# EAGLE design 808-Diginoise (EAGLE 7.1.0)
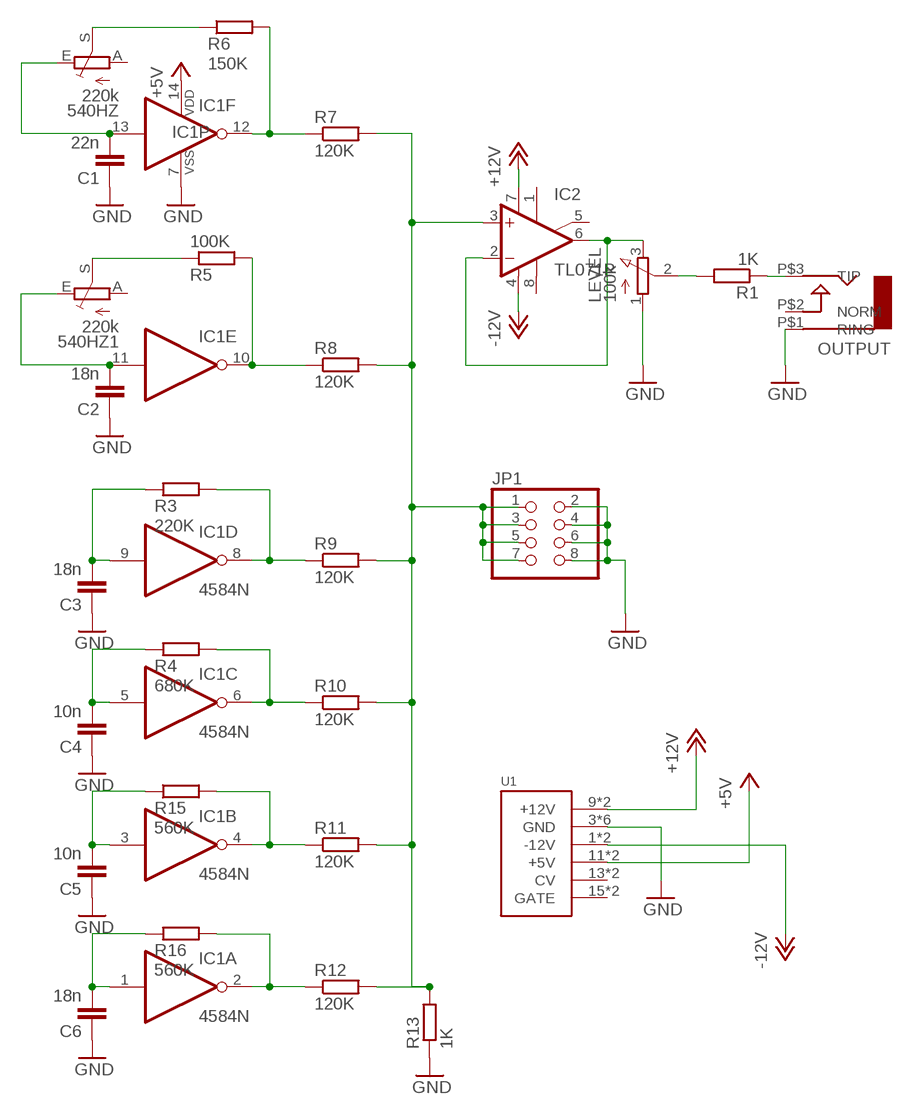
[diagram p0: schematic, sheet 1]

## Parts
540HZ  220k  TRIM_EU-B64Y  [B64Y]
540HZ1  220k  TRIM_EU-B64Y  [B64Y]
C1  22n  C-EU4MM_PITCH  [C035-030X60]
C2  18n  C-EU4MM_PITCH  [C035-030X60]
C3  18n  C-EU4MM_PITCH  [C035-030X60]
C4  10n  C-EU4MM_PITCH  [C035-030X60]
C5  10n  C-EU4MM_PITCH  [C035-030X60]
C6  18n  C-EU4MM_PITCH  [C035-030X60]
IC1  4584N  [DIL14]
IC2  TL071P  [DIL08]
JP1  PINHD-2X4  [2X04]
LEVEL  100k  3RP/1610N  [3RP/1610N]
OUTPUT  AUDIO-JACK  [ERTHENVAR-JACK-90DEG]
R1  1K  R-EU_0207/5V  [0207/5V]
R3  220K  R-EU_0207/5V  [0207/5V]
R4  680K  R-EU_0207/5V  [0207/5V]
R5  100K  R-EU_0207/5V  [0207/5V]
R6  150K  R-EU_0207/5V  [0207/5V]
R7  120K  R-EU_0207/5V  [0207/5V]
R8  120K  R-EU_0207/5V  [0207/5V]
R9  120K  R-EU_0207/5V  [0207/5V]
R10  120K  R-EU_0207/5V  [0207/5V]
R11  120K  R-EU_0207/5V  [0207/5V]
R12  120K  R-EU_0207/5V  [0207/5V]
R13  1K  R-EU_0207/5V  [0207/5V]
R15  560K  R-EU_0207/5V  [0207/5V]
R16  560K  R-EU_0207/5V  [0207/5V]
U1  POWER  [POWER_16]

## Nets
+5V: IC1.14(P:VDD) U1.11(+5V) U1.12(+5V)
+12V [Power]: IC2.7(V+) U1.9(+12V) U1.10(+12V)
-12V: IC2.4(V-) U1.1(-12V) U1.2(-12V)
GND [GND]: C1.P$1 C2.P$1 C3.P$1 C4.P$1 C5.P$1 C6.P$1 IC1.7(P:VSS) JP1.2 JP1.4 JP1.6 JP1.8 LEVEL.1(A) OUTPUT.P$1(RING) R13.1 U1.3(GND) U1.4(GND) U1.5(GND) U1.6(GND) U1.7(GND) U1.8(GND)
N$1: 540HZ1.E C2.P$2 IC1.11(E:I)
N$2: IC2.2(-IN) IC2.6(OUT) LEVEL.3(E)
N$3: 540HZ1.S R5.1
N$4: 540HZ.S R6.1
N$5: IC1.12(F:O) R6.2 R7.1
N$6: 540HZ.E C1.P$2 IC1.13(F:I)
N$7: LEVEL.2(S) R1.2
N$8: IC1.8(D:O) R3.2 R9.1
N$9: IC1.6(C:O) R4.2 R10.1
N$10: IC1.4(B:O) R11.1 R15.2
N$11: IC1.2(A:O) R12.1 R16.2
N$12: C3.P$2 IC1.9(D:I) R3.1
N$13: C6.P$2 IC1.1(A:I) R16.1
N$14: C5.P$2 IC1.3(B:I) R15.1
N$15: C4.P$2 IC1.5(C:I) R4.1
N$16: OUTPUT.P$3(TIP) R1.1
N$18: IC2.3(+IN) JP1.1 JP1.3 JP1.5 JP1.7 R7.2 R8.2 R9.2 R10.2 R11.2 R12.2 R13.2
TP7: IC1.10(E:O) R5.2 R8.1
Unconnected: 540HZ1.A 540HZ.A IC2.1(ON1) IC2.5(ON2) IC2.8(OPT) OUTPUT.P$2(NORM) U1.13(CV) U1.14(CV) U1.15(GATE) U1.16(GATE)

## Library data of the parts
540HZ 540HZ1 = bourns_ptd:TRIM_EU-: POTENTIOMETER
C1-C6 = TR808clone:C-EU: CAPACITOR, European symbol Pitch 3mm
IC1 = TR808clone:4584: Hex SCHMITT TRIGGER (74C14)
IC2 = linear:TL071: OP AMP
JP1 = adafruit:PINHD-2X4: PIN HEADER
LEVEL = pot:3RP/1610N: 16mm Potentiometer one level Source: http://www.alphapotentiometers.net/html/16mm_pot_2.html
OUTPUT = erthenvar:AUDIO-JACK: Switching Mono 3.5mm Audio Jack from Erthenvar.
R1 R3-R13 R15 R16 = TR808clone:R-EU_: RESISTOR, European symbol
U1 = eurorack:POWER

## Net classes
0 default: width 0.635 mm, drill 0.254 mm, clearance 0.254 mm
1 GND: width 1.016 mm, drill 1.016 mm, clearance 0.508 mm
2 Power: width 1.016 mm, drill 1.016 mm, clearance 0.508 mm

## Board
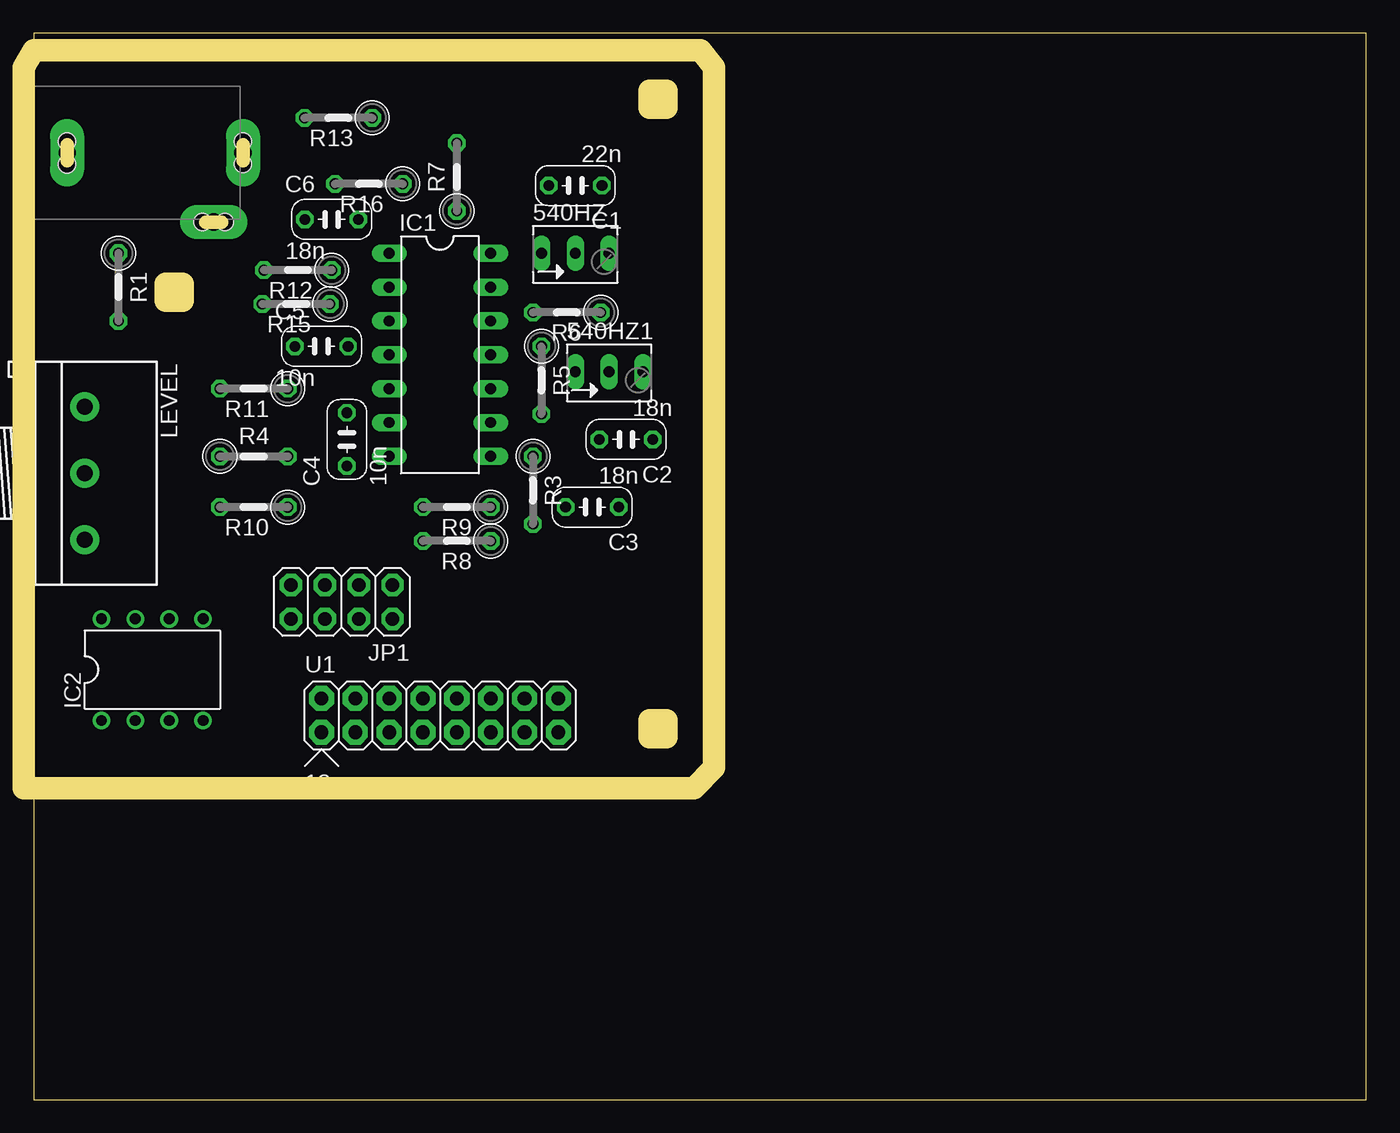
[diagram p1: board, top side]
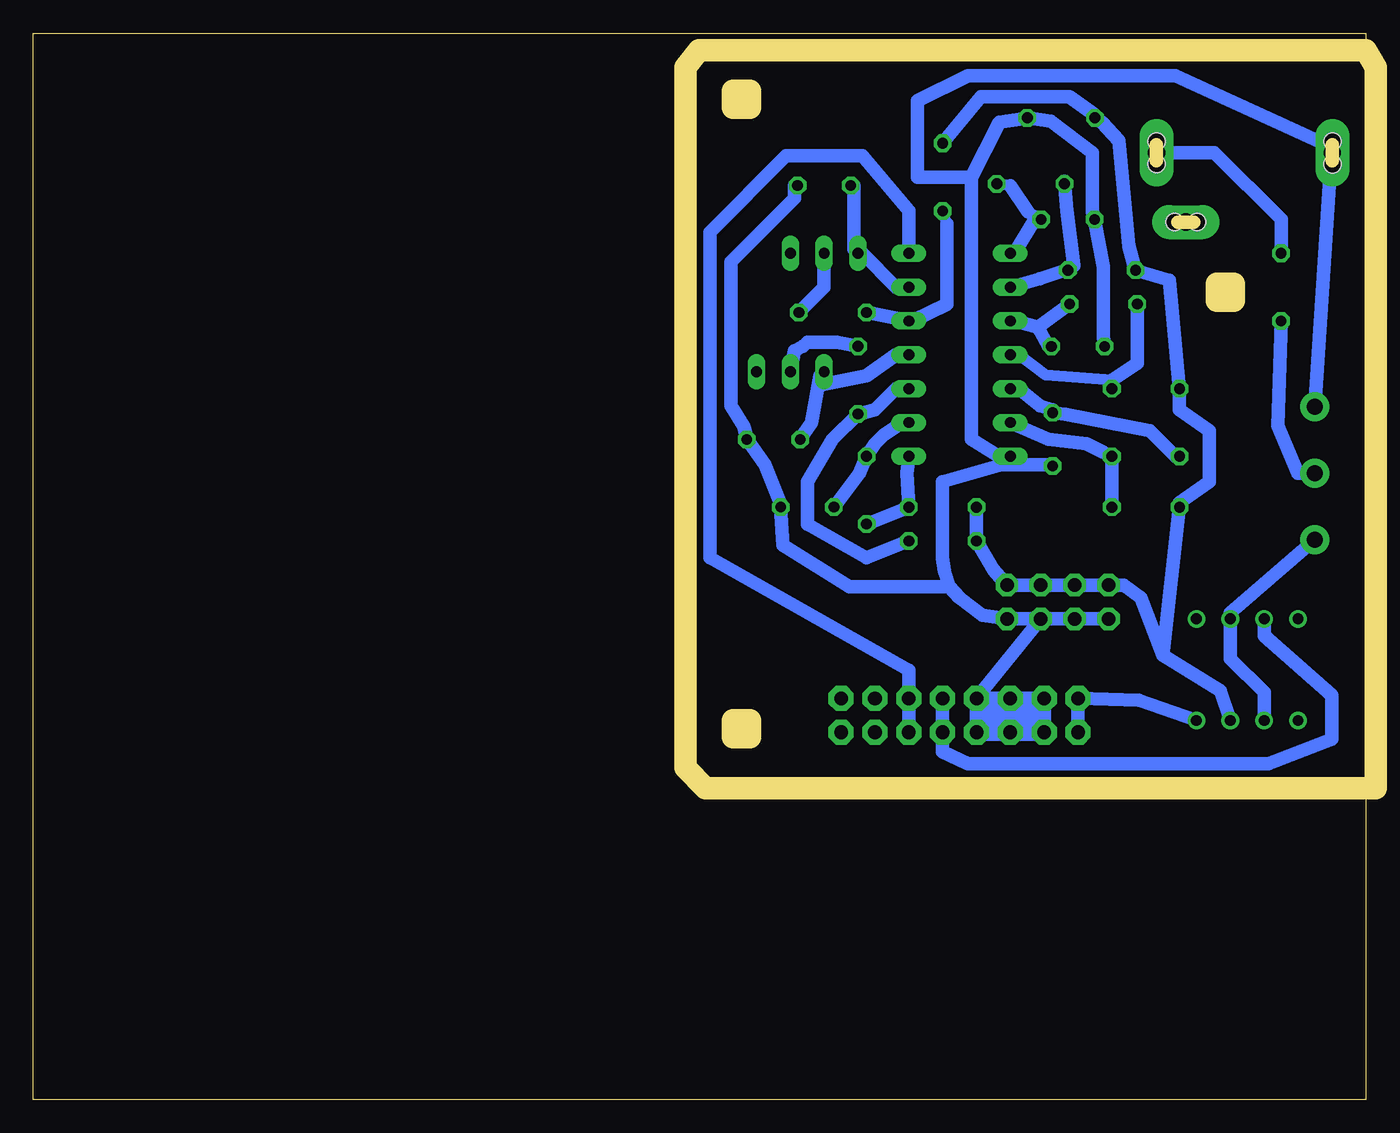
[diagram p2: board, bottom side, seen from below]

Size 100 x 80 mm. Coordinates in mm from the lower left corner, seen from the top.
Outline: 0,0 100,0 100,80 0,80 0,0
Copper layers (1*16): Top 0.035mm / dielectric 1.5mm / Bottom 0.035mm
Design rules "default *": minimum track width 32mil, minimum drill 31mil, track to track 18mil, track to pad 18mil, pad to pad 18mil, via to via 18mil, smd to smd 8mil, copper to edge 0mil, drill to drill 18mil, minimum pad ring 10mil, minimum via ring 8mil, stop-mask expansion 4mil, vias tented up to drill 0mil, thermal gap 10mil
Milling: 19 lines

### Footprints (pad centres in the part's own frame; a part is rotated, then mirrored left to right if it is on the bottom)
B64Y = drill 0.813 long: A 2.54,0; E -2.54,0; S 0,0
C035-030X60 = drill 0.8 octagon: P$1 -2,0; P$2 2,0
DIL14 = drill 0.813 long: 1 -7.62,-3.81; 2 -5.08,-3.81; 3 -2.54,-3.81; 4 0,-3.81; 5 2.54,-3.81; 6 5.08,-3.81; 7 7.62,-3.81; 8 7.62,3.81; 9 5.08,3.81; 10 2.54,3.81; 11 0,3.81; 12 -2.54,3.81; 13 -5.08,3.81; 14 -7.62,3.81
DIL08 = drill 0.813 pad 1.27: 1 -3.81,-3.81; 2 -1.27,-3.81; 3 1.27,-3.81; 4 3.81,-3.81; 5 3.81,3.81; 6 1.27,3.81; 7 -1.27,3.81; 8 -3.81,3.81
2X04 = drill 1.016 pad 1.676 octagon: 1 -3.81,-1.27; 2 -3.81,1.27; 3 -1.27,-1.27; 4 -1.27,1.27; 5 1.27,-1.27; 6 1.27,1.27; 7 3.81,-1.27; 8 3.81,1.27
3RP/1610N = drill 1.2 pad 2.184: 1 -5,0; 2 0,0; 3 5,0
ERTHENVAR-JACK-90DEG = drill 1.3 pad 2.54 long: P$1 5,-2.5; P$2 -0.2,-13.5; P$3 5,-15.7 | hole 1.3: 5.842,-2.489; 4.14,-2.489; -0.203,-12.649; -0.203,-14.351; 5.842,-15.697; 4.166,-15.697
0207/5V = drill 0.813 octagon: 1 -2.54,0; 2 2.54,0
POWER_16 = drill 1.016 pad 1.88 octagon: 1 -6.35,-1.27; 2 -6.35,1.27; 3 -3.81,-1.27; 4 -3.81,1.27; 5 -1.27,-1.27; 6 -1.27,1.27; 7 1.27,-1.27; 8 1.27,1.27; 9 3.81,-1.27; 10 3.81,1.27; 11 6.35,-1.27; 12 6.35,1.27; 13 8.89,-1.27; 14 8.89,1.27; 15 11.43,-1.27; 16 11.43,1.27

### Placement (x,y rotation side)
540HZ  40.64,63.5 0 top
540HZ1  43.18,54.61 0 top
C1  40.64,68.58 180 top
C2  44.45,49.53 180 top
C3  41.91,44.45 180 top
C4  23.5,49.53 90 top
C5  21.59,56.52 0 top
C6  22.35,66.04 0 top
IC1  30.48,55.88 270 top
IC2  8.89,32.26 0 top
JP1  23.11,37.34 180 top
LEVEL  3.81,46.99 270 top
OUTPUT  0,66.04 90 top
R1  6.35,60.96 270 top
R3  37.47,45.72 270 top
R4  16.51,48.26 0 top
R5  38.1,53.98 270 top
R6  40.01,59.05 180 top
R7  31.75,69.22 90 top
R8  31.75,41.91 180 top
R9  31.75,44.45 180 top
R10  16.51,44.45 180 top
R11  16.51,53.34 180 top
R12  19.81,62.23 180 top
R13  22.86,73.66 180 top
R15  19.68,59.69 180 top
R16  25.15,68.71 180 top
U1  27.94,28.83 0 top

### Tracks (layer width: path | path; a pad name or v marks a point on that pad's centre or on a via)
+5V
  Bottom 1.016: IC1.14 34.29,66.67 37.78,70.8 43.5,70.8 49.21,65.09 49.21,40.64 34.29,32.19 U1.12 U1.11
+12V
  Bottom 1.016: IC2.7 7.62,34.8 2.54,30.35 2.54,27.05 7.3,25.21 29.84,25.21 31.75,26.1 U1.9 U1.10
-12V
  Bottom 1.016: IC2.4 17.02,29.97 U1.2 U1.1
GND  (1 unrouted)
  Bottom 1.016: C5.P$1 19.68,57.15 19.68,62.48 C6.P$1 20.51,66.61 20.51,71.06 23.62,73.41 R13.1 25.72,73.6 27.5,73.34 29.59,69.22 | LEVEL.1 2.54,71.44 14.29,76.83 29.84,76.83 33.66,74.93 33.66,69.22 29.59,69.22 | 27.3,47.62 23.5,47.62 C4.P$1 | 27.3,47.62 IC1.7 26.99,47.94 29.59,49.53 29.59,69.22 | JP1.8 JP1.6 JP1.4 | JP1.4 JP1.2 28.77,36.32 30.48,37.66 31.24,38.48 | 27.3,47.62 31.75,46.35 31.75,40.64 31.62,39.62 31.24,38.48 | C1.P$1 42.86,68.58 42.86,67.63 47.62,62.87 47.62,52.07 46.67,50.48 C2.P$1 45.09,47.62 43.81,44.45 C3.P$1 43.75,41.59 38.73,38.48 31.24,38.48 | U1.7 U1.5 U1.3 U1.4 U1.6 U1.8 JP1.4
N$1
  Bottom 0.813: 40.96,54.29 540HZ1.E 40.64,53.66 | 35.24,55.88 IC1.11
  Bottom 1.016: 40.96,54.29 41.59,50.8 C2.P$2 | 35.24,55.88 37.47,54.29 40.64,53.66
N$2
  Bottom 1.016: IC2.2 7.62,30.54 10.16,33.08 IC2.6 10.16,36.51 LEVEL.3
N$3
  Bottom 0.813: 41.91,56.83 42.23,56.52
  Bottom 1.016: 540HZ1.S 42.86,56.2 42.23,56.52 | 41.91,56.83 39.69,56.83 R5.1
N$4
  Bottom 1.016: 540HZ.S 40.64,60.96 R6.1
N$5
  Bottom 0.813: 31.43,65.72 R7.1 | 33.97,58.42 IC1.12
  Bottom 1.016: R6.2 IC1.12 | 31.43,65.72 31.43,59.69 33.97,58.42
N$6
  Bottom 0.813: 38.42,63.82 540HZ.E 37.78,63.5 | 38.42,68.58 C1.P$2 | 35.24,60.96 IC1.13
  Bottom 1.016: 38.42,63.82 38.42,68.58 | 37.78,63.5 35.24,60.96
N$7
  Bottom 1.016: 3.56,46.99 LEVEL.2 5.08,46.99 6.6,50.55 R1.2
N$8
  Bottom 1.016: IC1.8 34.42,46.99 R9.1 R3.2
N$9
  Bottom 0.813: 19.68,48.58 19.37,48.26 R4.2
  Bottom 1.016: R4.2 R10.1 | IC1.6 23.81,49.53 20.95,49.21 19.68,48.58
N$10
  Bottom 0.813: R11.1 19.05,53.98 24,54.36 26.04,55.88 IC1.4
  Bottom 1.016: 19.05,53.98 17.14,55.24 R15.2
N$11
  Bottom 0.813: 22.54,62.23 R12.1 21.91,62.55 | 22.61,68.9 R16.2
  Bottom 1.016: IC1.2 24.45,61.59 22.54,62.23 | 22.61,68.9 22.42,66.67 21.91,62.55
N$12
  Bottom 0.813: 35.24,50.48 IC1.9
  Bottom 1.016: 35.24,50.48 36.2,49.85 36.83,49.21 R3.1 38.01,46.99 C3.P$2
N$13
  Bottom 0.813: IC1.1 26.35,63.5 | 24.83,66.04 C6.P$2 25.34,66.61 | 26.67,68.58 R16.1
  Bottom 1.016: 26.35,63.5 24.83,66.04 | 25.34,66.61 26.67,68.58
N$14
  Bottom 0.813: IC1.3 26.35,58.42 | 23.81,56.52 C5.P$2
  Bottom 1.016: 26.35,58.42 24.61,57.94 | 24.61,57.94 23.81,56.52 | 24.61,57.94 R15.1
N$15
  Bottom 0.813: IC1.5 26.04,53.34 | 23.5,51.75 C4.P$2 | 14.29,48.26 R4.1
  Bottom 1.016: 23.5,51.75 24.45,52.07 26.04,53.34 | 14.29,48.26 16.19,50.16 22.54,51.44 C4.P$2
N$16
  Bottom 1.016: OUTPUT.P$3 11.35,71.04 6.35,66.04 R1.1
N$18
  Bottom 0.813: 19.81,73.34 R13.2 20.38,73.91 | 13.97,44.77 R10.2
  Bottom 1.016: 19.81,73.34 18.54,71.94 17.78,64.01 R12.2 14.73,61.47 R11.2 13.97,51.75 11.75,50.16 11.75,46.35 13.97,44.77 | R7.2 28.89,75.25 22.23,75.25 20.38,73.91 | IC2.3 10.92,30.67 15.24,33.34 | R10.2 15.24,33.34 | 15.24,33.34 16.89,37.66 18.16,38.61 JP1.7 JP1.5 JP1.3 JP1.1 27.94,39.75 R8.2 R9.2
TP7
  Bottom 0.813: 35.24,53.34 IC1.10
  Bottom 1.016: 35.24,53.34 36.83,51.75 R5.2 40.01,49.53 41.91,46.35 41.91,43.18 37.47,40.64 R8.1
(copper drawn outside any net)
  shapes: Bottom area x1